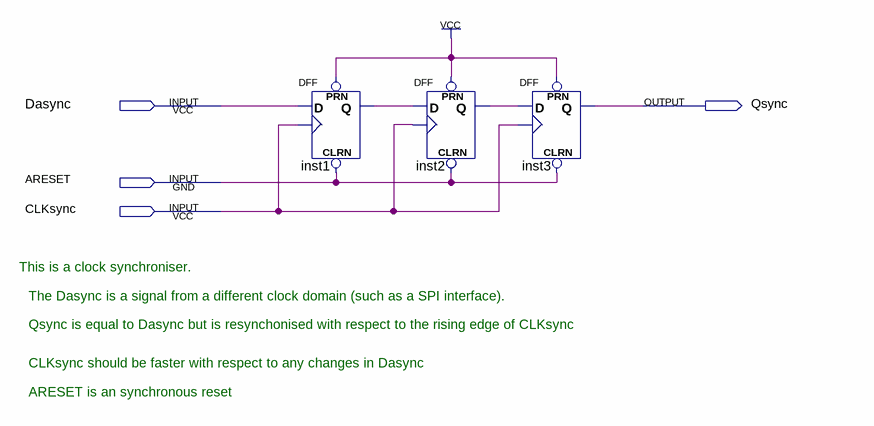
[diagram p0: schematic sheet]
// Quartus schematic cdc_synchroniser.bdf as structural Verilog: 3 symbols, 4 pins
module cdc_synchroniser (
  input  Dasync,
  input  ARESET,
  input  CLKsync,
  output Qsync
);

  wire inst1_q, inst2_q;

  DFF inst1 (.CLRN(ARESET), .CLK(CLKsync), .D(Dasync), .PRN(1'b1), .Q(inst1_q));
  DFF inst2 (.CLRN(ARESET), .CLK(CLKsync), .D(inst1_q), .PRN(1'b1), .Q(inst2_q));
  DFF inst3 (.CLRN(ARESET), .CLK(CLKsync), .D(inst2_q), .PRN(1'b1), .Q(Qsync));

  // Notes on the sheet:
  //   This is a clock synchroniser. 
  //   The Dasync is a signal from a different clock domain (such as a SPI interface). 
  //   Qsync is equal to Dasync but is resynchonised with respect to the rising edge of CLKsync
  //   CLKsync should be faster with respect to any changes in Dasync
  //   ARESET is an synchronous reset
endmodule
